# EAGLE design eduBoard (EAGLE 6.6.0)
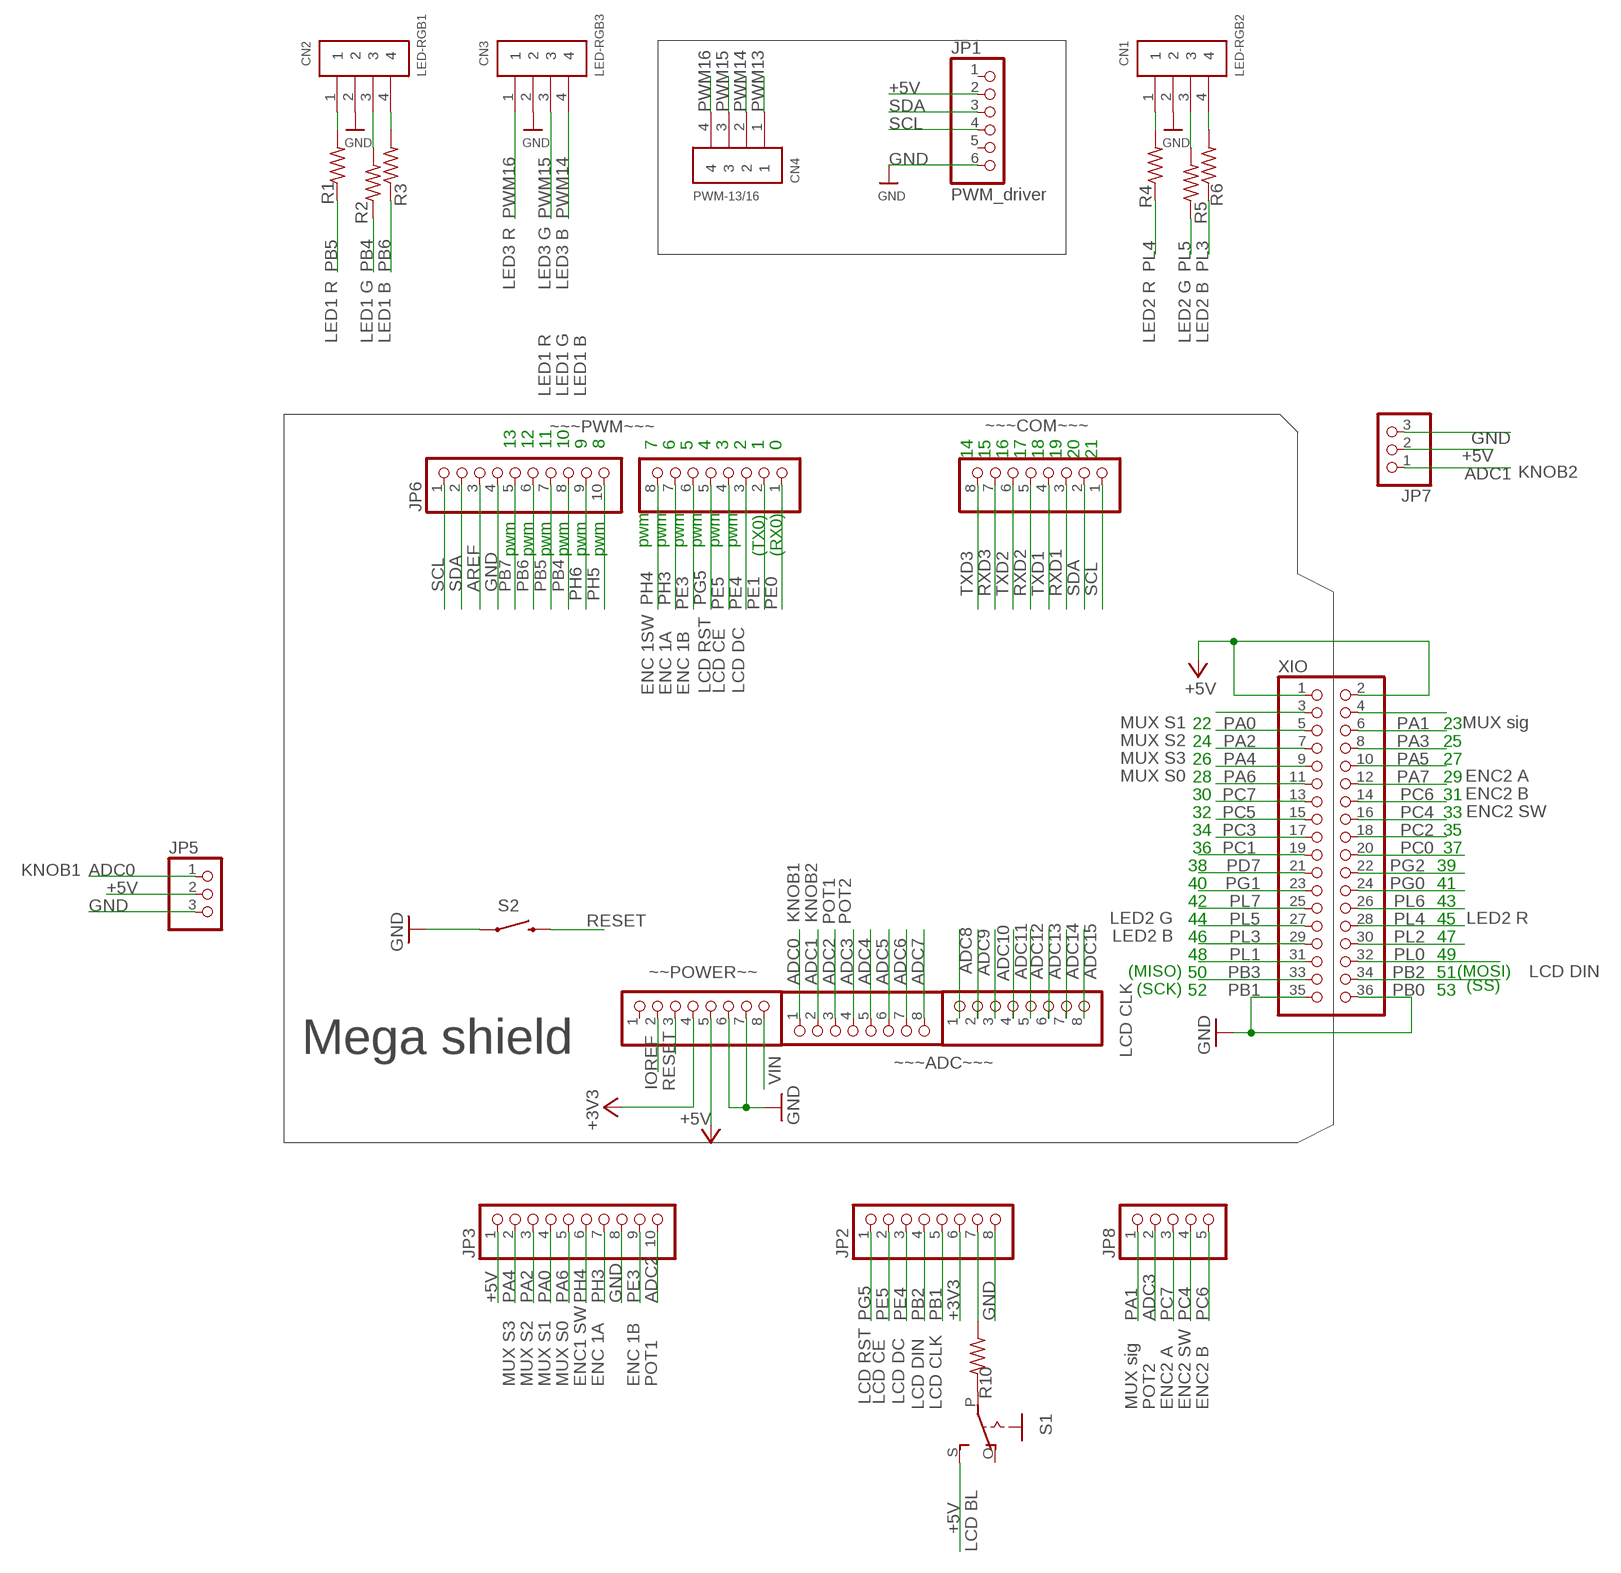
[diagram p0: schematic, sheet 1]

## Parts
ADCL  8x1F-H8.5  PINHD-1X8  [1X08]
CN1  LED-RGB2  1X4-BIG  [1X04-BIG]
CN2  LED-RGB1  1X4-BIG  [1X04-BIG]
CN3  LED-RGB3  1X4-BIG  [1X04-BIG]
CN4  PWM-13/16  1X4-BIG  [1X04-BIG]
JP1  PWM_driver  PINHD-1X6  [1X06]
JP2  PINHD-1X8OVAL  [1X08-OVAL]
JP3  PINHD-1X10_ARD  [1X10]
JP5  PINHD-1X3  [1X03]
JP6  10x1F-H8.5  PINHD-1X10_ARD  [1X10]
JP7  PINHD-1X3  [1X03]
JP8  HEADER-1X5  [1X05_OVAL]
R1  R-US_0207/10  [0207/10]
R2  R-US_0207/10  [0207/10]
R3  R-US_0207/10  [0207/10]
R4  R-US_0207/10  [0207/10]
R5  R-US_0207/10  [0207/10]
R6  R-US_0207/10  [0207/10]
R10  R-US_0207/10  [0207/10]
S1  EG1218S  [EG1218]
S2  SWITCH-MOMENTARY-2PTH  [TACTILE-PTH]
XIO  18x2F-H8.5  PINHD-2X18  [2X18]
~~POWER~~  8x1F-H8.5  PINHD-1X8  [1X08]
~~~ADC~~~  8x1F-H8.5  PINHD-1X8  [1X08]
~~~COM~~~  8x1F-H8.5  PINHD-1X8  [1X08]
~~~PWM~~~  8x1F-H8.5  PINHD-1X8  [1X08]

## Nets
+3V3: JP2.6 ~~POWER~~.4
+5V: JP1.2 JP3.1 JP5.2 JP7.2 S1.S XIO.1 XIO.2 ~~POWER~~.5
ADC0: ADCL.1 JP5.1
ADC1: ADCL.2 JP7.1
ADC2: ADCL.3 JP3.10
ADC3: ADCL.4 JP8.2
ADC4: ADCL.5
ADC5: ADCL.6
ADC6: ADCL.7
ADC7: ADCL.8
ADC8: ~~~ADC~~~.1
ADC9: ~~~ADC~~~.2
ADC10: ~~~ADC~~~.3
ADC11: ~~~ADC~~~.4
ADC12: ~~~ADC~~~.5
ADC13: ~~~ADC~~~.6
ADC14: ~~~ADC~~~.7
ADC15: ~~~ADC~~~.8
AREF: JP6.3
GND: CN1.2 CN2.2 CN3.2 JP1.6 JP2.8 JP3.8 JP5.3 JP6.4 JP7.3 S2.1 XIO.35 XIO.36 ~~POWER~~.6 ~~POWER~~.7
IOREF [power usb]: ~~POWER~~.2
N$2: CN2.3 R2.2
N$3: CN2.4 R3.2
N$5: CN1.1 R4.2
N$8: CN1.4 R6.2
N$9: CN2.1 R1.2
N$10: JP2.7 R10.2
N$12: CN1.3 R5.2
N$13: R10.1 S1.P
PA0: JP3.4 XIO.3
PA1: JP8.1 XIO.4
PA2: JP3.3 XIO.5
PA3: XIO.6
PA4: JP3.2 XIO.7
PA5: XIO.8
PA6: JP3.5 XIO.9
PA7: XIO.10
PB0: XIO.34
PB1: JP2.5 XIO.33
PB2: JP2.4 XIO.32
PB3: XIO.31
PB4: JP6.8 R2.1
PB5: JP6.7 R1.1
PB6: JP6.6 R3.1
PB7: JP6.5
PC0: XIO.18
PC1: XIO.17
PC2: XIO.16
PC3: XIO.15
PC4: JP8.4 XIO.14
PC5: XIO.13
PC6: JP8.5 XIO.12
PC7: JP8.3 XIO.11
PD7: XIO.19
PE0: ~~~PWM~~~.1
PE1: ~~~PWM~~~.2
PE3: JP3.9 ~~~PWM~~~.6
PE4: JP2.3 ~~~PWM~~~.3
PE5: JP2.2 ~~~PWM~~~.4
PG0: XIO.22
PG1: XIO.21
PG2: XIO.20
PG5: JP2.1 ~~~PWM~~~.5
PH3: JP3.7 ~~~PWM~~~.7
PH4: JP3.6 ~~~PWM~~~.8
PH5: JP6.10
PH6: JP6.9
PL0: XIO.30
PL1: XIO.29
PL2: XIO.28
PL3: R6.1 XIO.27
PL4: R4.1 XIO.26
PL5: R5.1 XIO.25
PL6: XIO.24
PL7: XIO.23
PWM13: CN4.1
PWM14: CN3.4 CN4.2
PWM15: CN3.3 CN4.3
PWM16: CN3.1 CN4.4
RESET: S2.3 ~~POWER~~.3
RXD1: ~~~COM~~~.3
RXD2: ~~~COM~~~.5
RXD3: ~~~COM~~~.7
SCL: JP1.4 JP6.1 ~~~COM~~~.1
SDA: JP1.3 JP6.2 ~~~COM~~~.2
TXD1: ~~~COM~~~.4
TXD2: ~~~COM~~~.6
TXD3: ~~~COM~~~.8
VIN [power]: ~~POWER~~.8
Unconnected: JP1.1 JP1.5 S1.O ~~POWER~~.1

## Notes on the sheet
- LED3 R | LED3 G | LED3 B
- LED1 R | LED1 G | LED1 B | LED2 R | LED2 G | LED2 B
- LED1 R | LED1 G | LED1 B
- 13 | 12 | 11 | 10 | 9 | 8 | 7 | 6 | 5 | 4 | 3 | 2 | 1 | 0
- 14 | 15 | 16 | 17 | 18 | 19 | 20 | 21
- KNOB2
- pwm | pwm | pwm | pwm | pwm | pwm
- pwm | pwm | pwm | pwm | pwm | pwm | (TX0) | (RX0)
- ENC 1SW | ENC 1A | ENC 1B | LCD RST | LCD CE | LCD DC
- MUX S1 | 22 | 23 | MUX sig
- MUX S2 | 24 | 25
- MUX S3 | 26 | 27
- MUX S0 | 28 | 29 | ENC2 A
- 30 | 31 | ENC2 B
- 32 | 33 | ENC2 SW
- 34 | 35
- 36 | 37
- 38 | 39
- KNOB1 | 40 | 41
- 42 | 43
- LED2 G | 44 | 45 | LED2 R
- KNOB1 | KNOB2 | POT1 | POT2
- LED2 B | 46 | 47
- 48 | 49
- (MISO) | 50 | 51 | (MOSI) | LCD DIN
- LCD CLK | (SCK) | 52 | 53 | (SS)
- Mega shield
- MUX S3 | MUX S2 | MUX S1 | MUX S0 | ENC1 SW | ENC 1A | ENC 1B | POT1
- LCD RST | LCD CE | LCD DC
- LCD DIN | LCD CLK | MUX sig | POT2 | ENC2 A | ENC2 SW | ENC2 B
- LCD BL

## Library data of the parts
ADCL ~~POWER~~ ~~~ADC~~~ ~~~COM~~~ ~~~PWM~~~ = SmartPrj:PINHD-1X8: PIN HEADER
CN1-CN4 = adafruit:1X4: 4-pin connector
JP1 = adafruit:PINHD-1X6: PIN HEADER
JP2 = eduBoard:PINHD-1X8: PIN HEADER
JP3 = eduBoard:PINHD-1X10_ARD: PIN HEADER
JP5 JP7 = adafruit:PINHD-1X3: PIN HEADER
JP6 = SmartPrj:PINHD-1X10_ARD: PIN HEADER
JP8 = eduBoard:HEADER-1X5: PIN HEADER
R1-R6 R10 = adafruit:R-US_: RESISTOR, American symbol
S1 = adafruit:EG1218: SLIDING SWITCH 0.1" spacing through hole, vertical SPDT slide switch http://www.ladyada.net/library/pcb/eaglelibrary.html
S2 = eduBoard:SWITCH-MOMENTARY-2: Various NO switches- pushbuttons, reed, etc
XIO = SmartPrj:PINHD-2X18: PIN HEADER

## Net classes
0 default: width 0.152 mm, drill 0.305 mm, clearance 0.152 mm
1 power: width 0.61 mm, drill 0.406 mm, clearance 0.203 mm
2 gnd: width 0.305 mm, drill 0.406 mm, clearance 0.203 mm
3 power usb: width 0.508 mm, drill 0.406 mm, clearance 0.203 mm

## Board
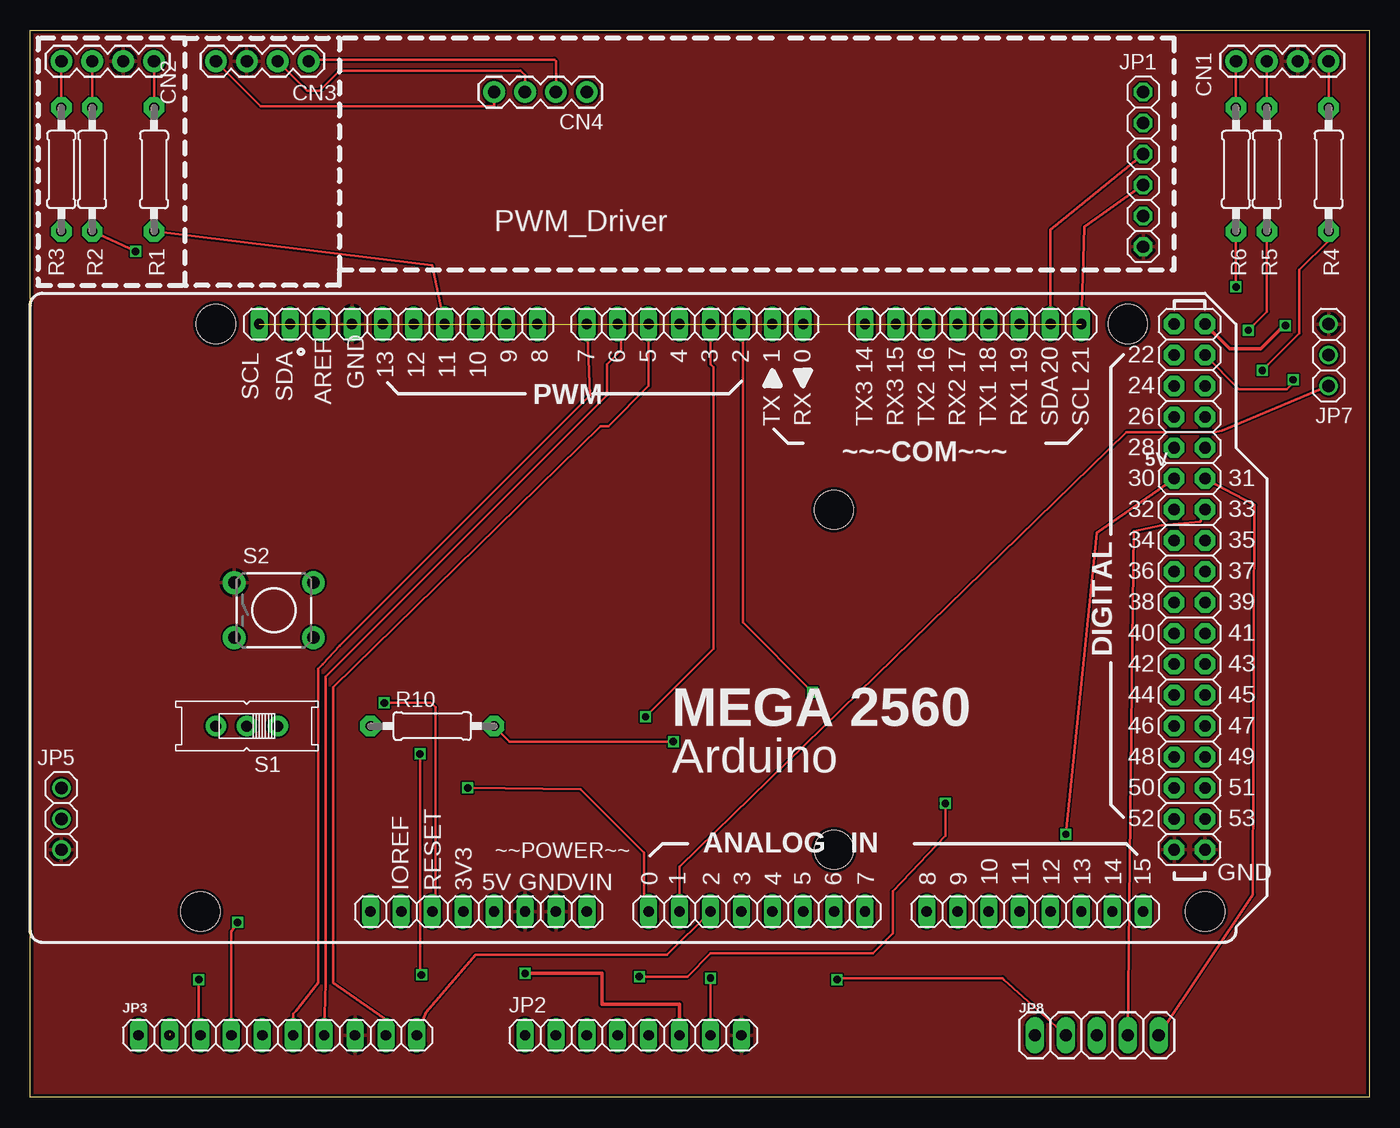
[diagram p1: board, top side]
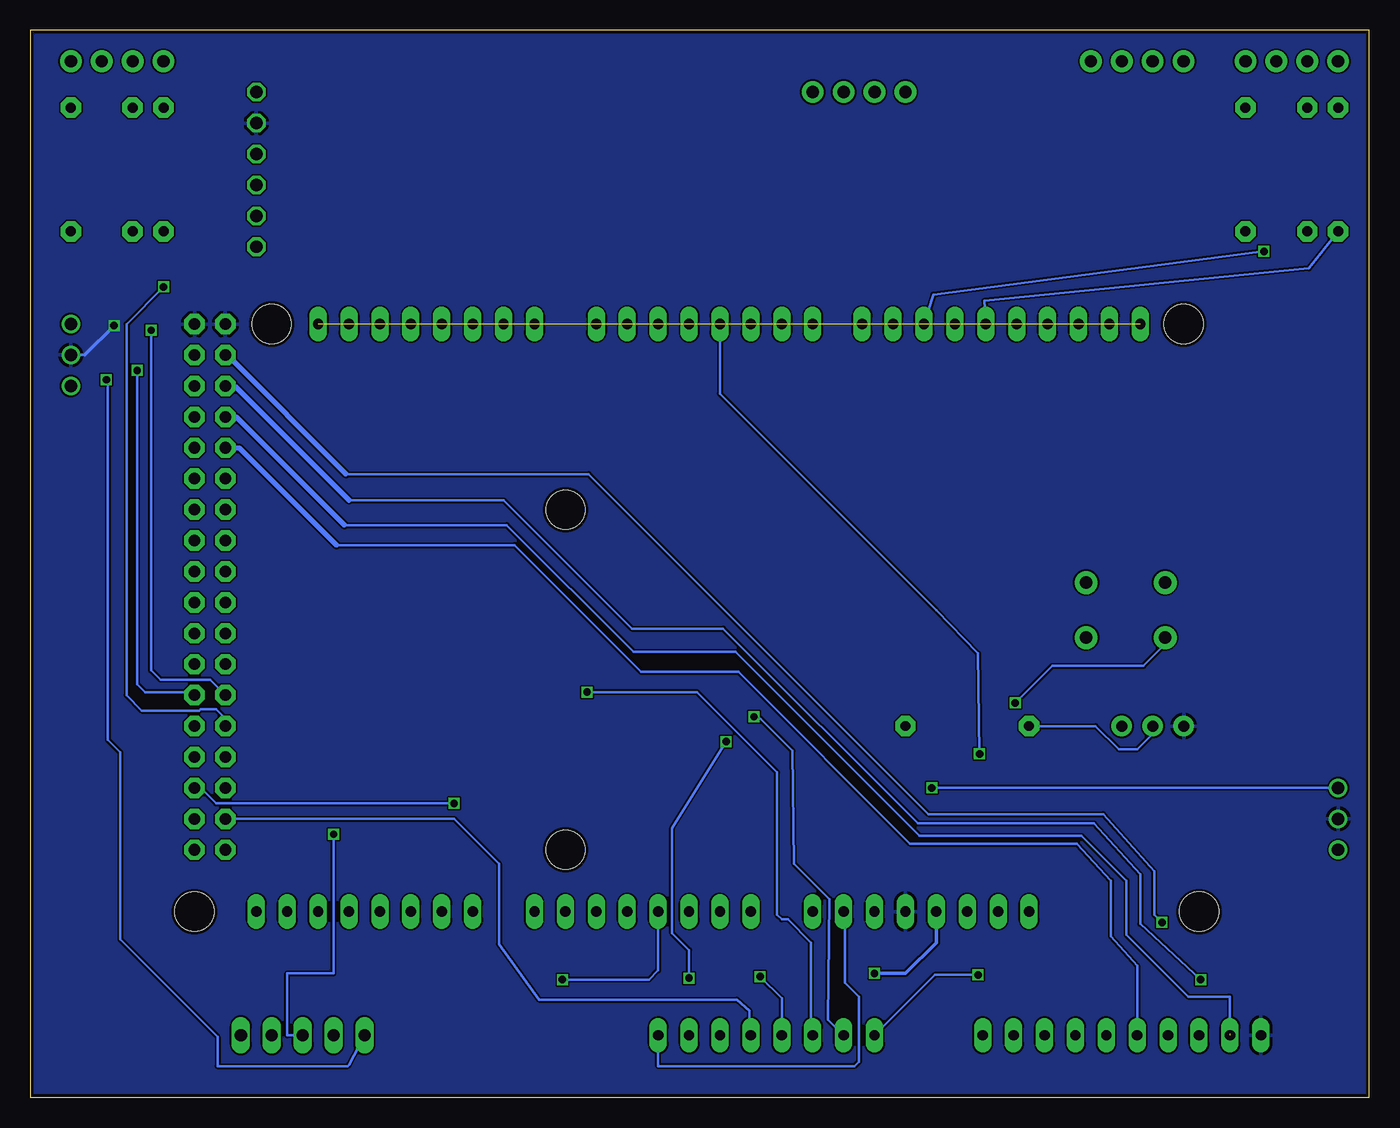
[diagram p2: board, bottom side, seen from below]

Size 110 x 87.62 mm. Coordinates in mm from the lower left corner, seen from the top.
Outline: 0,0 0,87.62 110,87.62 110,0 0,0
Copper layers (1*16): Top 0.035mm / dielectric 1.5mm / Bottom 0.035mm
Design rules "Elecrow_2-layer_eagle_rule": minimum track width 6mil, minimum drill 12mil, track to track 6mil, track to pad 6mil, pad to pad 6mil, via to via 6mil, smd to smd 0mil, copper to edge 10mil, drill to drill 10mil, minimum pad ring 10mil, minimum via ring 6mil, stop-mask expansion 2mil, vias tented up to drill 100mil, thermal gap 10mil
Holes 3.2 mm at 96.52,15.24 15.24,63.5 90.17,63.5 13.97,15.24 66.04,48.26 66.04,20.32

### Footprints (pad centres in the part's own frame; a part is rotated, then mirrored left to right if it is on the bottom)
1X08 = drill 0.85 pad 1.422 long: 1 -8.89,0; 2 -6.35,0; 3 -3.81,0; 4 -1.27,0; 5 1.27,0; 6 3.81,0; 7 6.35,0; 8 8.89,0
1X04-BIG = drill 1.016 pad 1.778: 1 0,0; 2 2.54,0; 3 5.08,0; 4 7.62,0
1X06 = drill 1.016 octagon: 1 -6.35,0; 2 -3.81,0; 3 -1.27,0; 4 1.27,0; 5 3.81,0; 6 6.35,0
1X08-OVAL = drill 0.85 pad 1.422 long: 1 0,0; 2 2.54,0; 3 5.08,0; 4 7.62,0; 5 10.16,0; 6 12.7,0; 7 15.24,0; 8 17.78,0
1X10 = drill 0.85 pad 1.422 long: 1 -11.43,0; 2 -8.89,0; 3 -6.35,0; 4 -3.81,0; 5 -1.27,0; 6 1.27,0; 7 3.81,0; 8 6.35,0; 9 8.89,0; 10 11.43,0
1X03 = drill 1.016: 1 -2.54,0; 2 0,0; 3 2.54,0
1X05_OVAL = drill 1 long: 1 -5.08,0; 2 -2.54,0; 3 0,0; 4 2.54,0; 5 5.08,0
0207/10 = drill 0.813 pad 1.676 octagon: 1 -5.08,0; 2 5.08,0
EG1218 = drill 0.9 pad 1.676: O -2.54,0; P 0,0; S 2.54,0
TACTILE-PTH = drill 1.016 pad 1.88: 1 -3.251,2.261; 2 3.251,2.261; 3 -3.251,-2.261; 4 3.251,-2.261
2X18 = drill 0.95 pad 1.676 octagon: 1 -21.59,-1.27; 2 -21.59,1.27; 3 -19.05,-1.27; 4 -19.05,1.27; 5 -16.51,-1.27; 6 -16.51,1.27; 7 -13.97,-1.27; 8 -13.97,1.27; 9 -11.43,-1.27; 10 -11.43,1.27; 11 -8.89,-1.27; 12 -8.89,1.27; 13 -6.35,-1.27; 14 -6.35,1.27; 15 -3.81,-1.27; 16 -3.81,1.27; 17 -1.27,-1.27; 18 -1.27,1.27; 19 1.27,-1.27; 20 1.27,1.27; 21 3.81,-1.27; 22 3.81,1.27; 23 6.35,-1.27; 24 6.35,1.27; 25 8.89,-1.27; 26 8.89,1.27; 27 11.43,-1.27; 28 11.43,1.27; 29 13.97,-1.27; 30 13.97,1.27; 31 16.51,-1.27; 32 16.51,1.27; 33 19.05,-1.27; 34 19.05,1.27; 35 21.59,-1.27; 36 21.59,1.27

### Placement (x,y rotation side)
ADCL  59.69,15.24 0 top
CN1  106.68,85.09 180 top
CN2  10.16,85.09 180 top
CN3  15.24,85.09 0 top
CN4  45.72,82.55 180 top
JP1  91.44,76.2 270 top
JP2  40.64,5.08 0 top
JP3  20.32,5.08 0 top
JP5  2.54,22.86 270 top
JP6  30.23,63.5 0 top
JP7  106.68,60.96 90 top
JP8  87.63,5.08 0 top
R1  10.16,76.2 90 top
R2  5.08,76.2 90 top
R3  2.54,76.2 90 top
R4  106.68,76.2 90 top
R5  101.6,76.2 90 top
R6  99.06,76.2 90 top
R10  33.02,30.48 0 top
S1  17.78,30.48 180 top
S2  20,40 0 top
XIO  95.25,41.91 270 top
~~POWER~~  36.83,15.24 0 top
~~~ADC~~~  82.55,15.24 0 top
~~~COM~~~  77.47,63.5 180 top
~~~PWM~~~  54.61,63.5 180 top

### Tracks (layer width: path | path; a pad name or v marks a point on that pad's centre or on a via)
+3V3  (via drill 0.6)
  Top 0.305: v40.64,10.16 46.99,10.16 46.99,7.62 53.34,7.62 JP2.6
  Bottom 0.305: ~~POWER~~.4 35.56,12.7 38.1,10.16 v40.64,10.16
+5V  (via drill 0.6)
  Top 0.305: XIO.2 98.55,61.47 101.09,61.47 103,63.37 v103.12,63.37
  Bottom 0.203: 105.54,60.96 JP7.2
  Bottom 0.305: v103.12,63.37 105.54,60.96
  pour Bottom: 0,88.9 0,0 111.76,0 111.76,88.9
ADC0  (via drill 0.6)
  Top 0.203: v35.94,25.4 45.21,25.27 50.42,20.07 50.42,15.62 ADCL.1
  Bottom 0.203: JP5.1 v35.94,25.4
ADC1
  Top 0.203: JP7.1 97.92,54.74 97.28,54.61 90.04,54.61 53.34,18.92 ADCL.2
ADC2
  Top 0.203: JP3.10 32.51,6.99 36.58,11.68 52.32,11.68 ADCL.3
ADC3  (via drill 0.6)
  Top 0.203: v66.29,9.65 66.42,9.78 79.88,9.78 80.01,9.65 JP8.2
  Bottom 0.203: ADCL.4 58.42,10.41 59.18,9.65 v66.29,9.65
GND
  Bottom 0.203: ~~POWER~~.7 43.05,15.11 43.05,9.4 41.91,8.26 41.91,2.92 42.29,2.54 58.42,2.54 JP2.8
  pour Top: 0,90.17 0,0 113.03,0 113.03,90.17
N$2
  Top 0.203: CN2.3 R2.2
N$3
  Top 0.203: R3.2 CN2.4
N$5
  Top 0.203: CN1.1 R4.2
N$8
  Top 0.203: CN1.4 R6.2
N$9
  Top 0.203: R1.2 CN2.1
N$10  (via drill 0.6)
  Top 0.203: v52.83,29.21 39.37,29.21 R10.2 | JP2.7 v55.88,9.78
  Bottom 0.203: v52.83,29.21 57.28,22.1 57.28,13.46 55.88,12.06 v55.88,9.78
N$12
  Top 0.203: R5.2 CN1.3
N$13
  Bottom 0.203: R10.1 22.48,30.48 20.57,28.57 19.05,28.57 17.65,29.97 17.65,30.35 S1.P
PA0  (via drill 0.6)
  Top 0.203: v17.02,14.35 16.51,13.59 JP3.4
  Bottom 0.203: 84.07,51.18 64.14,51.18 36.2,23.24 21.84,23.24 17.65,18.54 17.65,14.99 v17.02,14.35
  Bottom 0.406: XIO.3 93.85,60.96 84.07,51.18
PA1  (via drill 0.6)
  Top 0.203: XIO.4 99.31,58.17 103.25,58.17 103.76,58.67 v103.76,58.93
  Bottom 0.203: v103.76,58.93 103.63,58.8 103.63,29.34 102.62,28.32 102.62,12.95 94.61,4.95 94.61,2.54 83.95,2.54 83.82,2.67 JP8.1
PA2  (via drill 0.6)
  Top 0.203: v13.84,9.65 13.84,5.21 JP3.3
  Bottom 0.203: 83.82,49.02 71.12,49.02 60.58,38.48 53.09,38.48 37.08,22.48 22.61,22.48 18.8,18.29 18.8,14.22 v13.84,9.65
  Bottom 0.406: XIO.5 93.22,58.42 83.82,49.02
PA4  (1 unrouted)
  Bottom 0.203: 84.2,46.99 70.87,46.99 60.45,36.58 52.07,36.58 36.96,21.46 23.62,21.46 19.94,17.78 19.94,13.34 14.86,8.26 11.56,8.26 11.43,8.26 11.43,5.21
  Bottom 0.406: XIO.7 93.09,55.88 84.2,46.99
PA6
  Bottom 0.203: 84.84,45.34 70.23,45.34 59.82,34.92 51.82,34.92 37.72,20.83 24,20.83 21.21,17.78 21.21,13.21 19.05,10.79 JP3.5 19.05,6.35
  Bottom 0.406: XIO.9 92.84,53.34 84.84,45.34
PB1
  Bottom 0.203: XIO.33 75.18,22.86 71.5,19.18 71.5,12.57 68.2,8 51.94,8 50.93,7.11 50.93,5.21 JP2.5
PB2  (via drill 0.6)
  Top 0.203: v50.04,9.91 53.98,9.91 55.88,11.81 69.22,11.81 70.87,13.46 70.87,16.89 75.18,21.46 v75.18,24.13
  Bottom 0.203: 96.52,25.27 95.89,25.27 94.74,24.13 v75.18,24.13 | JP2.4 48.26,8.13 v50.04,9.91
  Bottom 0.406: XIO.32 96.52,25.27
PB4  (via drill 0.6)
  Top 0.203: R2.1 v8.64,69.47
  Bottom 0.203: v8.64,69.47 35.81,65.91 JP6.8
PB5
  Top 0.203: R1.1 33.02,68.33 JP6.7
PB6
  Bottom 0.203: R3.1 4.95,68.07 31.62,65.41 JP6.6
PC4
  Top 0.203: JP8.4 90.55,37.34 90.68,46.48 92.96,46.99 96.14,47.24 XIO.14
PC6
  Top 0.203: JP8.5 100.46,16.64 100.58,48.64 XIO.12
PC7  (via drill 0.6)
  Top 0.203: v85.09,21.59 87.63,46.35 XIO.11
  Bottom 0.203: JP8.3 88.9,5.08 88.9,10.16 85.09,10.16 v85.09,21.59
PE3
  Top 0.203: ~~~PWM~~~.6 50.8,58.42 47.5,55.12 46.86,55.12 24.89,33.66 24.89,9.4 29.08,6.48 29.21,6.1 JP3.9
PE4  (via drill 0.6)
  Top 0.203: v64.26,33.27 58.55,38.99 58.55,62.48 58.42,62.61 ~~~PWM~~~.3
  Bottom 0.203: JP2.3 45.85,5.21 45.85,12.7 47.75,14.61 48.26,14.61 48.64,14.99 48.64,26.67 55.24,33.27 v64.26,33.27
PE5  (via drill 0.6)
  Top 0.203: v50.55,31.24 56.13,36.83 56.13,59.94 55.88,60.2 ~~~PWM~~~.4
  Bottom 0.203: JP2.2 44.45,6.35 44.32,16.26 47.24,19.18 47.37,28.45 50.16,31.24 v50.55,31.24
PG5  (via drill 0.6)
  Top 0.203: v32,28.19 32,10.16 v32.13,10.03
  Bottom 0.203: ~~~PWM~~~.5 53.34,57.78 35.56,40.01 32.13,36.45 v32,28.19 | v32.13,10.03 35.69,10.03 JP2.1
PH3
  Top 0.203: ~~~PWM~~~.7 48.51,63.25 48.51,61.34 47.37,60.2 47.37,57.66 24.26,34.54 24.26,9.4 24.13,5.46 JP3.7
PH4
  Top 0.203: ~~~PWM~~~.8 45.97,57.66 25.4,37.08 24,35.56 23.62,35.18 23.62,9.4 21.84,7.11 21.59,6.86 JP3.6
PL3  (via drill 0.6)
  Top 0.203: R6.1 v99.06,66.55
  Bottom 0.203: v99.06,66.55 102.11,63.5 102.11,33.02 100.84,31.75 96.14,31.75 96.01,31.88 94.74,31.88 93.98,31.11 XIO.27
PL4  (via drill 0.6)
  Top 0.203: v101.22,59.69 104.27,62.74 104.27,67.94 106.68,70.36 R4.1
  Bottom 0.203: XIO.26 96.77,33.27 100.58,33.27 101.22,33.91 v101.22,59.69
PL5  (via drill 0.6)
  Top 0.203: v100.08,62.99 101.6,64.52 R5.1
  Bottom 0.203: XIO.25 95.25,34.29 99.31,34.29 100.08,35.05 v100.08,62.99
PWM14
  Top 0.203: CN3.4 22.99,85.22 43.05,85.22 43.18,85.09 CN4.2
PWM15
  Top 0.203: CN3.3 22.73,82.68 23.75,82.68 25.4,84.33 40.26,84.33 40.64,83.95 CN4.3
PWM16
  Top 0.203: CN3.1 18.92,81.41 38.1,81.41 CN4.4
RESET  (via drill 0.6)
  Top 0.203: ~~POWER~~.3 33.27,15.49 33.27,32 32.89,32.38 v29.08,32.38
  Bottom 0.203: v29.08,32.38 26.04,35.43 18.54,35.43 16.75,37.23 S2.3
SCL  (1 unrouted)
  Top 0.203: ~~~COM~~~.1 86.61,71.5 JP1.4
SDA  (1 unrouted)
  Top 0.203: JP1.3 83.82,71.25 ~~~COM~~~.2

### Text on the board
tPlace: PWM_Driver | 9 | 8 | 7 | 6 | 5 | 4 | 3 | 2 | 1 | 0 | 22 | 13 | 12 | 11 | 10 | 14 | 15 | 16 | 17 | 18 | 19 | 20 | 21 | 24 | 26 | 28 | 30 | 31 | 32 | 33 | 34 | 35 | 36 | 37 | 38 | 39 | 40 | 41 | 42 | 43 | 44 | 45 | 46 | 47 | 48 | 49 | 50 | 51 | 52 | 53 | 0 | 1 | 2 | 3 | 4 | 5 | 6 | 7 | 8 | 9 | 10 | 11 | 12 | 13 | 14 | 15
tNames: GND | SCL | SDA | AREF | PWM | TX | RX | TX3 | RX3 | TX2 | RX2 | TX1 | RX1 | SDA | SCL | 5V | DIGITAL | MEGA 2560 | Arduino | ANALOG IN | GND | IOREF | RESET | 3V3 | 5V | GND | VIN